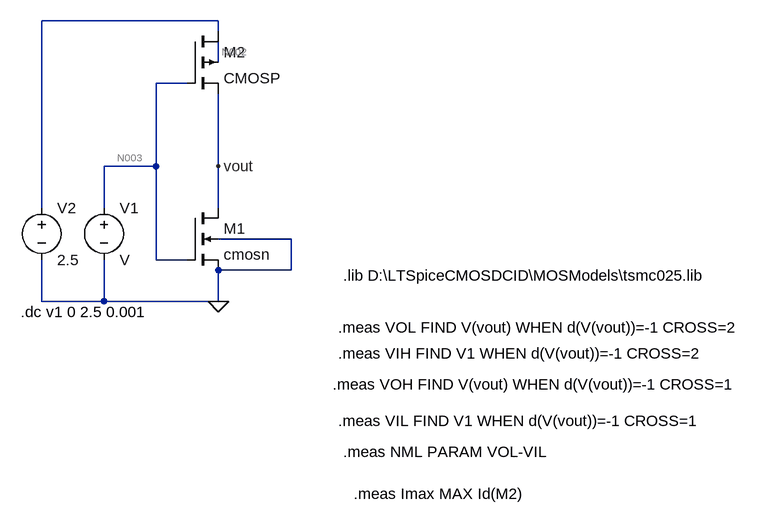
[diagram p0: schematic 250_switching.asc]
250_switching.asc, the LTspice schematic file:
Version 4
SHEET 1 1064 680
WIRE 224 -272 -48 -272
WIRE 224 -256 224 -272
WIRE 224 -208 224 -240
WIRE 176 -176 128 -176
WIRE 128 -48 128 -176
WIRE 128 -48 48 -48
WIRE 224 -48 224 -160
WIRE -48 16 -48 -272
WIRE 48 16 48 -48
WIRE 224 16 224 -48
WIRE 336 64 224 64
WIRE 128 96 128 -48
WIRE 176 96 128 96
WIRE 336 112 336 64
WIRE 336 112 224 112
WIRE -48 160 -48 96
WIRE 48 160 48 96
WIRE 48 160 -48 160
WIRE 224 160 224 112
WIRE 224 160 48 160
FLAG 224 -48 vout
FLAG 224 160 0
SYMBOL nmos4 176 16 R0
SYMATTR InstName M1
SYMATTR Value cmosn
SYMATTR Value2 l=250n w=360n ad=0.1728p as=0.1728p pd=1680n ps=1680n
SYMBOL voltage 48 0 R0
SYMATTR InstName V1
SYMBOL voltage -48 0 R0
WINDOW 123 0 0 Left 0
WINDOW 39 0 0 Left 0
SYMATTR InstName V2
SYMATTR Value 2.5
SYMBOL cmosp 176 -256 R0
SYMATTR InstName M2
SYMATTR Value2 l=250n w=360n ad=0.1728p as=0.1728p pd=1680n ps=1680n
TEXT -80 176 Left 2 !.dc v1 0 2.5 0.001
TEXT 416 120 Left 2 !.lib D:\\LTSpiceCMOSDCID\\MOSModels\\tsmc025.lib
TEXT 408 200 Left 2 !.meas VOL FIND V(vout) WHEN d(V(vout))=-1 CROSS=2
TEXT 408 240 Left 2 !.meas VIH FIND V1 WHEN d(V(vout))=-1 CROSS=2
TEXT 400 288 Left 2 !.meas VOH FIND V(vout) WHEN d(V(vout))=-1 CROSS=1
TEXT 408 344 Left 2 !.meas VIL FIND V1 WHEN d(V(vout))=-1 CROSS=1
TEXT 416 392 Left 2 !.meas NML PARAM VOL-VIL
TEXT 432 456 Left 2 !.meas Imax MAX Id(M2)

The netlist it stands for:
* 250_switching.asc
M1 vout N003 0 0 cmosn l=250n w=360n ad=0.1728p as=0.1728p pd=1680n ps=1680n
V1 N003 0 V
V2 N001 0 2.5
M2 N001 N003 vout N002 CMOSP l=250n w=360n ad=0.1728p as=0.1728p pd=1680n ps=1680n
.model NMOS NMOS
.model PMOS PMOS
.lib standard.mos
.dc v1 0 2.5 0.001
.lib D:\LTSpiceCMOSDCID\MOSModels\tsmc025.lib
.meas VOL FIND V(vout) WHEN d(V(vout))=-1 CROSS=2
.meas VIH FIND V1 WHEN d(V(vout))=-1 CROSS=2
.meas VOH FIND V(vout) WHEN d(V(vout))=-1 CROSS=1
.meas VIL FIND V1 WHEN d(V(vout))=-1 CROSS=1
.meas NML PARAM VOL-VIL
.meas Imax MAX Id(M2)
.backanno
.end

* Results of the author's LTspice run, read from the files saved beside the schematic
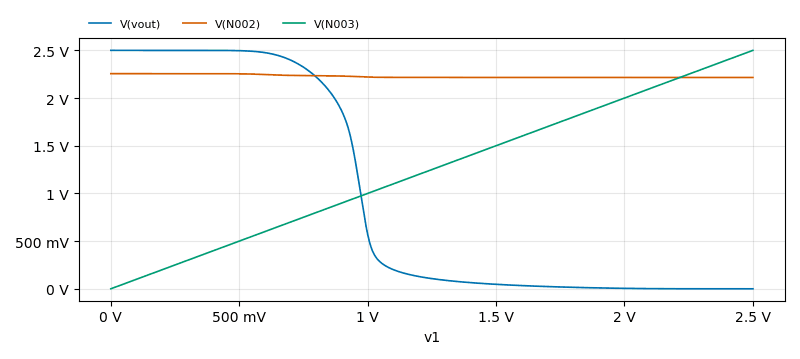
[diagram p1: DC transfer characteristic of 250_switching.asc, plotted from the saved traces]
* DC transfer characteristic, 1 run:
*   V(vout): 2.5 V at v1=0 V, 839.6 nV at v1=2.5 V, min 839.6 nV, max 2.5 V
*   V(N002): 2.256 V at v1=0 V, 2.216 V at v1=2.5 V, min 2.216 V, max 2.256 V
*   V(N003): 0 V at v1=0 V, 2.5 V at v1=2.5 V, min 0 V, max 2.5 V
* From the log:
*   vol: v(vout)=0.192508 at 1.10792
*   vih: v1=1.10792 at 1.10792
*   voh: v(vout)=2.42368 at 0.676932
*   vil: v1=0.676932 at 0.676932
*   nml: vol-vil=-0.484425
*   imax: MAX(id(m2))=2.06488e-05 FROM 0 TO 2.5